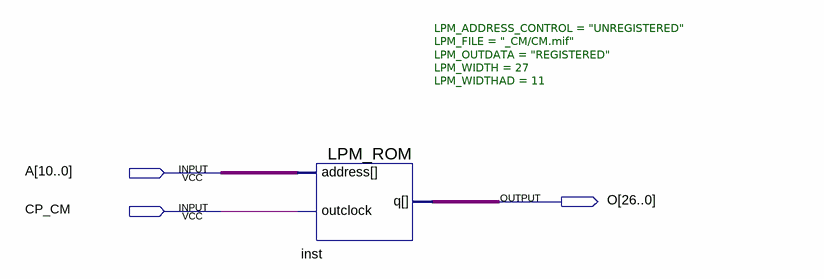
[diagram p0: schematic sheet]
// Quartus schematic CM.bdf as structural Verilog: 1 symbols, 3 pins
module CM (
  input  [10:0] A,
  input  CP_CM,
  output [26:0] O
);

  LPM_ROM #(.LPM_ADDRESS_CONTROL("UNREGISTERED"), .LPM_FILE("_CM/CM.mif"), .LPM_OUTDATA("REGISTERED"), .LPM_WIDTH(27), .LPM_WIDTHAD(11)) inst (
    .address(A), .outclock(CP_CM), .q(O));
endmodule
